# Altium schematic sheet New Member Design Schematic.SchDoc
size A
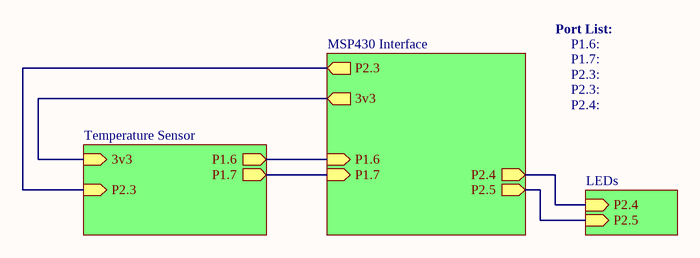
[diagram p0: New Member Design Schematic.SchDoc]

## Sub-sheets
LEDs = Status LEDs.SchDoc: P2.4 (in), P2.5 (in)
MSP430 Interface = Launchpad.SchDoc: P2.4 (out), P2.5 (out), P1.6 (in), P1.7 (in), P2.3 (out), 3v3 (out)
Temperature Sensor = Temperature Sensor.SchDoc: P1.6 (out), P1.7 (out), 3v3 (in), P2.3 (in)

## Nets
(unnamed): sheet MSP430 Interface/P2.4, sheet LEDs/P2.4
(unnamed): sheet MSP430 Interface/P2.5, sheet LEDs/P2.5
(unnamed): sheet MSP430 Interface/P1.6, sheet Temperature Sensor/P1.6
(unnamed): sheet MSP430 Interface/P1.7, sheet Temperature Sensor/P1.7
(unnamed): sheet MSP430 Interface/P2.3, sheet Temperature Sensor/P2.3
(unnamed): sheet MSP430 Interface/3v3, sheet Temperature Sensor/3v3

## Notes on the sheet
- Port List:
- P1.6:
- P1.7:
- P2.3:
- P2.4: